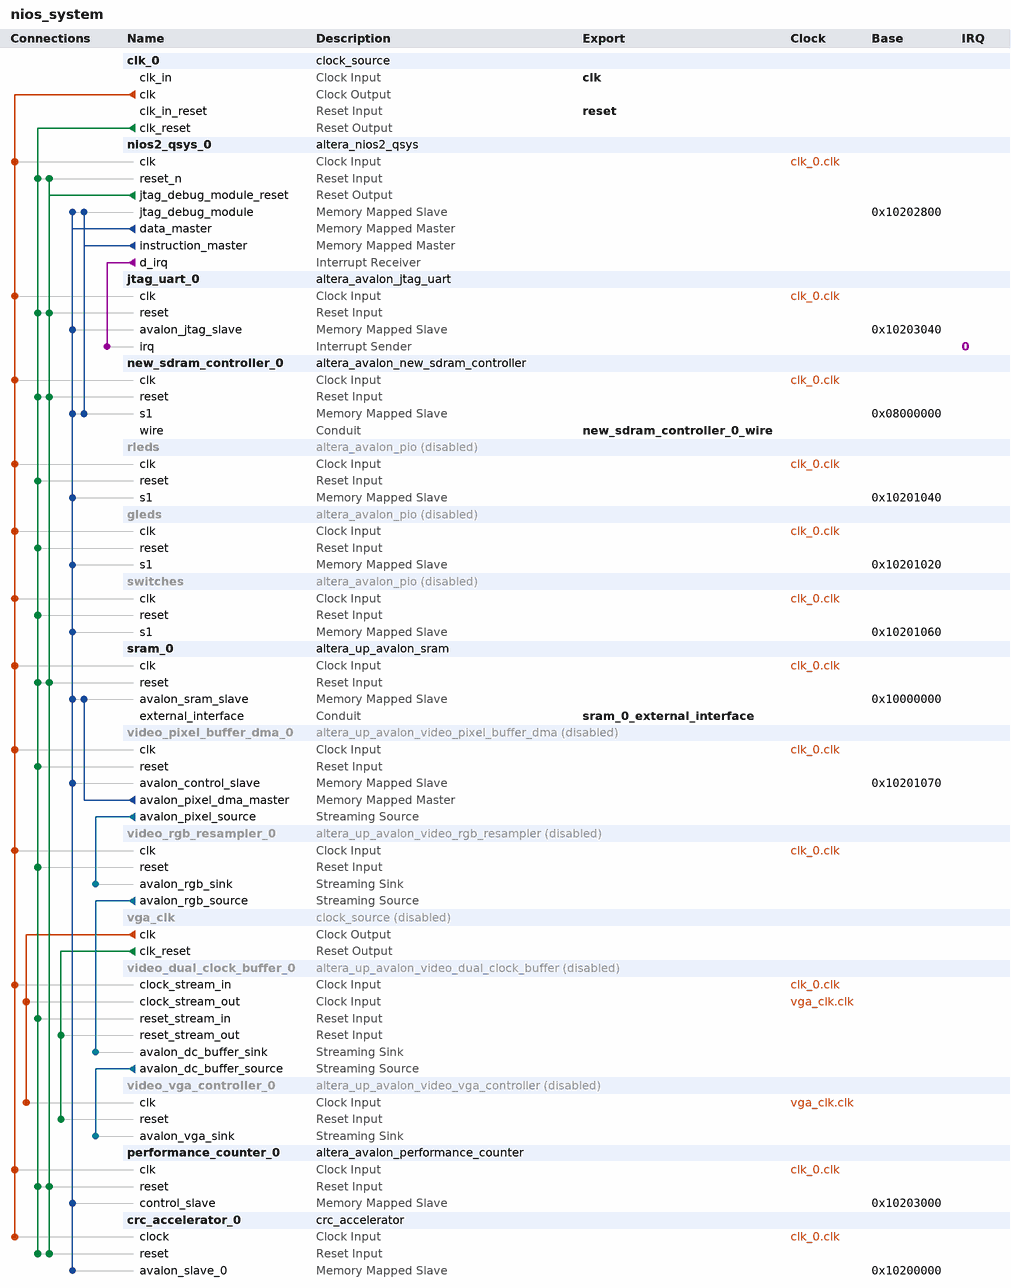
[diagram p0: system contents]
# Platform Designer (Qsys) system nios_system, Cyclone IV E EP4CE115F29C7
# Parameters at their usual value, and those the tool derives, are not listed.
package require -exact qsys 17.0
create_system nios_system
set_project_property DEVICE_FAMILY {Cyclone IV E}
set_project_property DEVICE EP4CE115F29C7

add_instance clk_0 clock_source 17.0
set_instance_parameter_value clk_0 clockFrequency 50000000

add_instance nios2_qsys_0 altera_nios2_qsys 16.1
set_instance_parameter_value nios2_qsys_0 breakSlave nios2_qsys_0.jtag_debug_module
set_instance_parameter_value nios2_qsys_0 exceptionSlave new_sdram_controller_0.s1
set_instance_parameter_value nios2_qsys_0 icache_size 4096
set_instance_parameter_value nios2_qsys_0 impl Tiny
set_instance_parameter_value nios2_qsys_0 mmu_TLBMissExcSlave None
set_instance_parameter_value nios2_qsys_0 resetSlave new_sdram_controller_0.s1
set_instance_parameter_value nios2_qsys_0 resetrequest_enabled true

add_instance jtag_uart_0 altera_avalon_jtag_uart 17.0
set_instance_parameter_value jtag_uart_0 simInteractiveOptions NO_INTERACTIVE_WINDOWS

add_instance new_sdram_controller_0 altera_avalon_new_sdram_controller 17.0
set_instance_parameter_value new_sdram_controller_0 TAC 5.5
set_instance_parameter_value new_sdram_controller_0 TRCD 20.0
set_instance_parameter_value new_sdram_controller_0 TRP 20.0
set_instance_parameter_value new_sdram_controller_0 casLatency 3
set_instance_parameter_value new_sdram_controller_0 columnWidth 10
set_instance_parameter_value new_sdram_controller_0 dataWidth 32
set_instance_parameter_value new_sdram_controller_0 generateSimulationModel true
set_instance_parameter_value new_sdram_controller_0 model single_Micron_MT48LC4M32B2_7_chip
set_instance_parameter_value new_sdram_controller_0 numberOfBanks 4
set_instance_parameter_value new_sdram_controller_0 numberOfChipSelects 1
set_instance_parameter_value new_sdram_controller_0 powerUpDelay 200.0
set_instance_parameter_value new_sdram_controller_0 refreshPeriod 7.8125
set_instance_parameter_value new_sdram_controller_0 rowWidth 13

add_instance rleds altera_avalon_pio 17.0
set_instance_property rleds ENABLED false
set_instance_parameter_value rleds bitModifyingOutReg true
set_instance_parameter_value rleds direction Output
set_instance_parameter_value rleds width 18

add_instance gleds altera_avalon_pio 17.0
set_instance_property gleds ENABLED false
set_instance_parameter_value gleds bitModifyingOutReg true
set_instance_parameter_value gleds direction Output
set_instance_parameter_value gleds width 8

add_instance switches altera_avalon_pio 17.0
set_instance_property switches ENABLED false
set_instance_parameter_value switches direction Input
set_instance_parameter_value switches simDoTestBenchWiring true
set_instance_parameter_value switches width 18

add_instance sram_0 altera_up_avalon_sram 17.0
set_instance_parameter_value sram_0 board DE2-115
set_instance_parameter_value sram_0 pixel_buffer true

add_instance video_pixel_buffer_dma_0 altera_up_avalon_video_pixel_buffer_dma 17.0
set_instance_property video_pixel_buffer_dma_0 ENABLED false
set_instance_parameter_value video_pixel_buffer_dma_0 addr_mode Consecutive
set_instance_parameter_value video_pixel_buffer_dma_0 back_start_address 269484032
set_instance_parameter_value video_pixel_buffer_dma_0 color_space {16-bit RGB}
set_instance_parameter_value video_pixel_buffer_dma_0 image_height 480
set_instance_parameter_value video_pixel_buffer_dma_0 image_width 640
set_instance_parameter_value video_pixel_buffer_dma_0 start_address 268435456

add_instance video_rgb_resampler_0 altera_up_avalon_video_rgb_resampler 17.0
set_instance_property video_rgb_resampler_0 ENABLED false
set_instance_parameter_value video_rgb_resampler_0 alpha 1023
set_instance_parameter_value video_rgb_resampler_0 input_type {16-bit RGB}
set_instance_parameter_value video_rgb_resampler_0 output_type {30-bit RGB}

add_instance vga_clk clock_source 17.0
set_instance_property vga_clk ENABLED false
set_instance_parameter_value vga_clk clockFrequency 25000000

add_instance video_dual_clock_buffer_0 altera_up_avalon_video_dual_clock_buffer 17.0
set_instance_property video_dual_clock_buffer_0 ENABLED false
set_instance_parameter_value video_dual_clock_buffer_0 color_bits 10

add_instance video_vga_controller_0 altera_up_avalon_video_vga_controller 17.0
set_instance_property video_vga_controller_0 ENABLED false
set_instance_parameter_value video_vga_controller_0 board DE2-115
set_instance_parameter_value video_vga_controller_0 resolution {VGA 640x480}

add_instance performance_counter_0 altera_avalon_performance_counter 17.0
set_instance_parameter_value performance_counter_0 numberOfSections 2

add_instance crc_accelerator_0 crc_accelerator 1.0

# connections
add_connection clk_0.clk crc_accelerator_0.clock clock
add_connection clk_0.clk gleds.clk clock
add_connection clk_0.clk jtag_uart_0.clk clock
add_connection clk_0.clk new_sdram_controller_0.clk clock
add_connection clk_0.clk nios2_qsys_0.clk clock
add_connection clk_0.clk performance_counter_0.clk clock
add_connection clk_0.clk rleds.clk clock
add_connection clk_0.clk sram_0.clk clock
add_connection clk_0.clk switches.clk clock
add_connection clk_0.clk video_dual_clock_buffer_0.clock_stream_in clock
add_connection clk_0.clk video_pixel_buffer_dma_0.clk clock
add_connection clk_0.clk video_rgb_resampler_0.clk clock
add_connection vga_clk.clk video_dual_clock_buffer_0.clock_stream_out clock
add_connection vga_clk.clk video_vga_controller_0.clk clock
add_connection clk_0.clk_reset crc_accelerator_0.reset reset
add_connection clk_0.clk_reset gleds.reset reset
add_connection clk_0.clk_reset jtag_uart_0.reset reset
add_connection clk_0.clk_reset new_sdram_controller_0.reset reset
add_connection clk_0.clk_reset nios2_qsys_0.reset_n reset
add_connection clk_0.clk_reset performance_counter_0.reset reset
add_connection clk_0.clk_reset rleds.reset reset
add_connection clk_0.clk_reset sram_0.reset reset
add_connection clk_0.clk_reset switches.reset reset
add_connection clk_0.clk_reset video_dual_clock_buffer_0.reset_stream_in reset
add_connection clk_0.clk_reset video_pixel_buffer_dma_0.reset reset
add_connection clk_0.clk_reset video_rgb_resampler_0.reset reset
add_connection nios2_qsys_0.jtag_debug_module_reset crc_accelerator_0.reset reset
add_connection nios2_qsys_0.jtag_debug_module_reset jtag_uart_0.reset reset
add_connection nios2_qsys_0.jtag_debug_module_reset new_sdram_controller_0.reset reset
add_connection nios2_qsys_0.jtag_debug_module_reset nios2_qsys_0.reset_n reset
add_connection nios2_qsys_0.jtag_debug_module_reset performance_counter_0.reset reset
add_connection nios2_qsys_0.jtag_debug_module_reset sram_0.reset reset
add_connection vga_clk.clk_reset video_dual_clock_buffer_0.reset_stream_out reset
add_connection vga_clk.clk_reset video_vga_controller_0.reset reset
add_connection nios2_qsys_0.data_master crc_accelerator_0.avalon_slave_0 avalon
set_connection_parameter_value nios2_qsys_0.data_master/crc_accelerator_0.avalon_slave_0 baseAddress 0x10200000
add_connection nios2_qsys_0.data_master gleds.s1 avalon
set_connection_parameter_value nios2_qsys_0.data_master/gleds.s1 baseAddress 0x10201020
add_connection nios2_qsys_0.data_master jtag_uart_0.avalon_jtag_slave avalon
set_connection_parameter_value nios2_qsys_0.data_master/jtag_uart_0.avalon_jtag_slave baseAddress 0x10203040
add_connection nios2_qsys_0.data_master new_sdram_controller_0.s1 avalon
set_connection_parameter_value nios2_qsys_0.data_master/new_sdram_controller_0.s1 baseAddress 0x08000000
add_connection nios2_qsys_0.data_master nios2_qsys_0.jtag_debug_module avalon
set_connection_parameter_value nios2_qsys_0.data_master/nios2_qsys_0.jtag_debug_module baseAddress 0x10202800
add_connection nios2_qsys_0.data_master performance_counter_0.control_slave avalon
set_connection_parameter_value nios2_qsys_0.data_master/performance_counter_0.control_slave baseAddress 0x10203000
add_connection nios2_qsys_0.data_master rleds.s1 avalon
set_connection_parameter_value nios2_qsys_0.data_master/rleds.s1 baseAddress 0x10201040
add_connection nios2_qsys_0.data_master sram_0.avalon_sram_slave avalon
set_connection_parameter_value nios2_qsys_0.data_master/sram_0.avalon_sram_slave baseAddress 0x10000000
add_connection nios2_qsys_0.data_master switches.s1 avalon
set_connection_parameter_value nios2_qsys_0.data_master/switches.s1 baseAddress 0x10201060
add_connection nios2_qsys_0.data_master video_pixel_buffer_dma_0.avalon_control_slave avalon
set_connection_parameter_value nios2_qsys_0.data_master/video_pixel_buffer_dma_0.avalon_control_slave baseAddress 0x10201070
add_connection nios2_qsys_0.instruction_master new_sdram_controller_0.s1 avalon
set_connection_parameter_value nios2_qsys_0.instruction_master/new_sdram_controller_0.s1 baseAddress 0x08000000
add_connection nios2_qsys_0.instruction_master nios2_qsys_0.jtag_debug_module avalon
set_connection_parameter_value nios2_qsys_0.instruction_master/nios2_qsys_0.jtag_debug_module baseAddress 0x10202800
add_connection video_pixel_buffer_dma_0.avalon_pixel_dma_master sram_0.avalon_sram_slave avalon
set_connection_parameter_value video_pixel_buffer_dma_0.avalon_pixel_dma_master/sram_0.avalon_sram_slave baseAddress 0x10000000
add_connection video_dual_clock_buffer_0.avalon_dc_buffer_source video_vga_controller_0.avalon_vga_sink avalon_streaming
add_connection video_pixel_buffer_dma_0.avalon_pixel_source video_rgb_resampler_0.avalon_rgb_sink avalon_streaming
add_connection video_rgb_resampler_0.avalon_rgb_source video_dual_clock_buffer_0.avalon_dc_buffer_sink avalon_streaming
add_connection nios2_qsys_0.d_irq jtag_uart_0.irq interrupt
set_connection_parameter_value nios2_qsys_0.d_irq/jtag_uart_0.irq irqNumber 0

# exported interfaces
add_interface clk clock sink
set_interface_property clk EXPORT_OF clk_0.clk_in
add_interface new_sdram_controller_0_wire conduit end
set_interface_property new_sdram_controller_0_wire EXPORT_OF new_sdram_controller_0.wire
add_interface reset reset sink
set_interface_property reset EXPORT_OF clk_0.clk_in_reset
add_interface sram_0_external_interface conduit end
set_interface_property sram_0_external_interface EXPORT_OF sram_0.external_interface

set_interconnect_requirement {$system} qsys_mm.clockCrossingAdapter HANDSHAKE
set_interconnect_requirement {$system} qsys_mm.enableEccProtection FALSE
set_interconnect_requirement {$system} qsys_mm.insertDefaultSlave FALSE
set_interconnect_requirement {$system} qsys_mm.maxAdditionalLatency 1

save_system nios_system.qsys
